# Altium project Tostado.PrjPcb
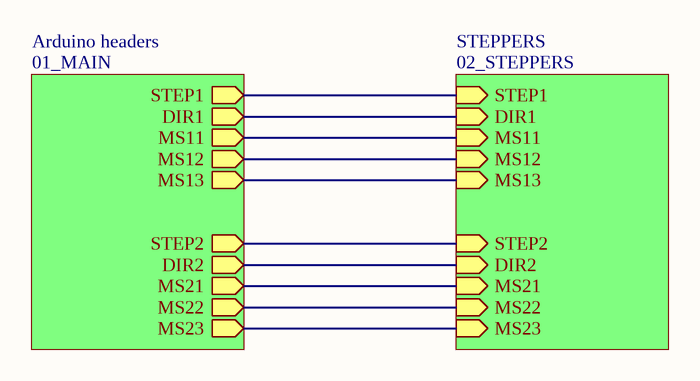
[diagram p0: GENERAL_DIAGRAMS.SchDoc]
3 sheets, 33 parts. Net scope: hierarchical (ports join the sheet entries above them; power ports are global).
Board file: Tostado.PcbDoc
Sheets:
  GENERAL_DIAGRAMS.SchDoc
    Arduino headers = 01_MAIN.SchDoc
    STEPPERS = 02_STEPPERS.SchDoc

## Sheet GENERAL_DIAGRAMS.SchDoc
size A4; SheetNumber: 1; SheetTotal: 3

### Sub-sheets
Arduino headers = 01_MAIN: STEP1 (out), DIR1 (out), MS11 (out), MS12 (out), MS13 (out), STEP2 (out), DIR2 (out), MS21 (out), MS22 (out), MS23 (out)
STEPPERS = 02_STEPPERS: STEP1 (in), DIR1 (in), MS11 (in), MS12 (in), MS13 (in), STEP2 (in), DIR2 (in), MS21 (in), MS22 (in), MS23 (in)

### Nets
3_MS22: sheet Arduino headers/MS22, sheet STEPPERS/MS22
4_MS21: sheet Arduino headers/MS21, sheet STEPPERS/MS21
4_MS23: sheet Arduino headers/MS23, sheet STEPPERS/MS23
5_MS11: sheet Arduino headers/MS11, sheet STEPPERS/MS11
6_STEP2: sheet Arduino headers/STEP2, sheet STEPPERS/STEP2
7_MS12: sheet Arduino headers/MS12, sheet STEPPERS/MS12
8_MS13: sheet Arduino headers/MS13, sheet STEPPERS/MS13
9_STEP1: sheet Arduino headers/STEP1, sheet STEPPERS/STEP1
12_DIR2: sheet Arduino headers/DIR2, sheet STEPPERS/DIR2
13_DIR1: sheet Arduino headers/DIR1, sheet STEPPERS/DIR1

## Sheet 01_MAIN.SchDoc
size A4; SheetNumber: 2; SheetTotal: 3
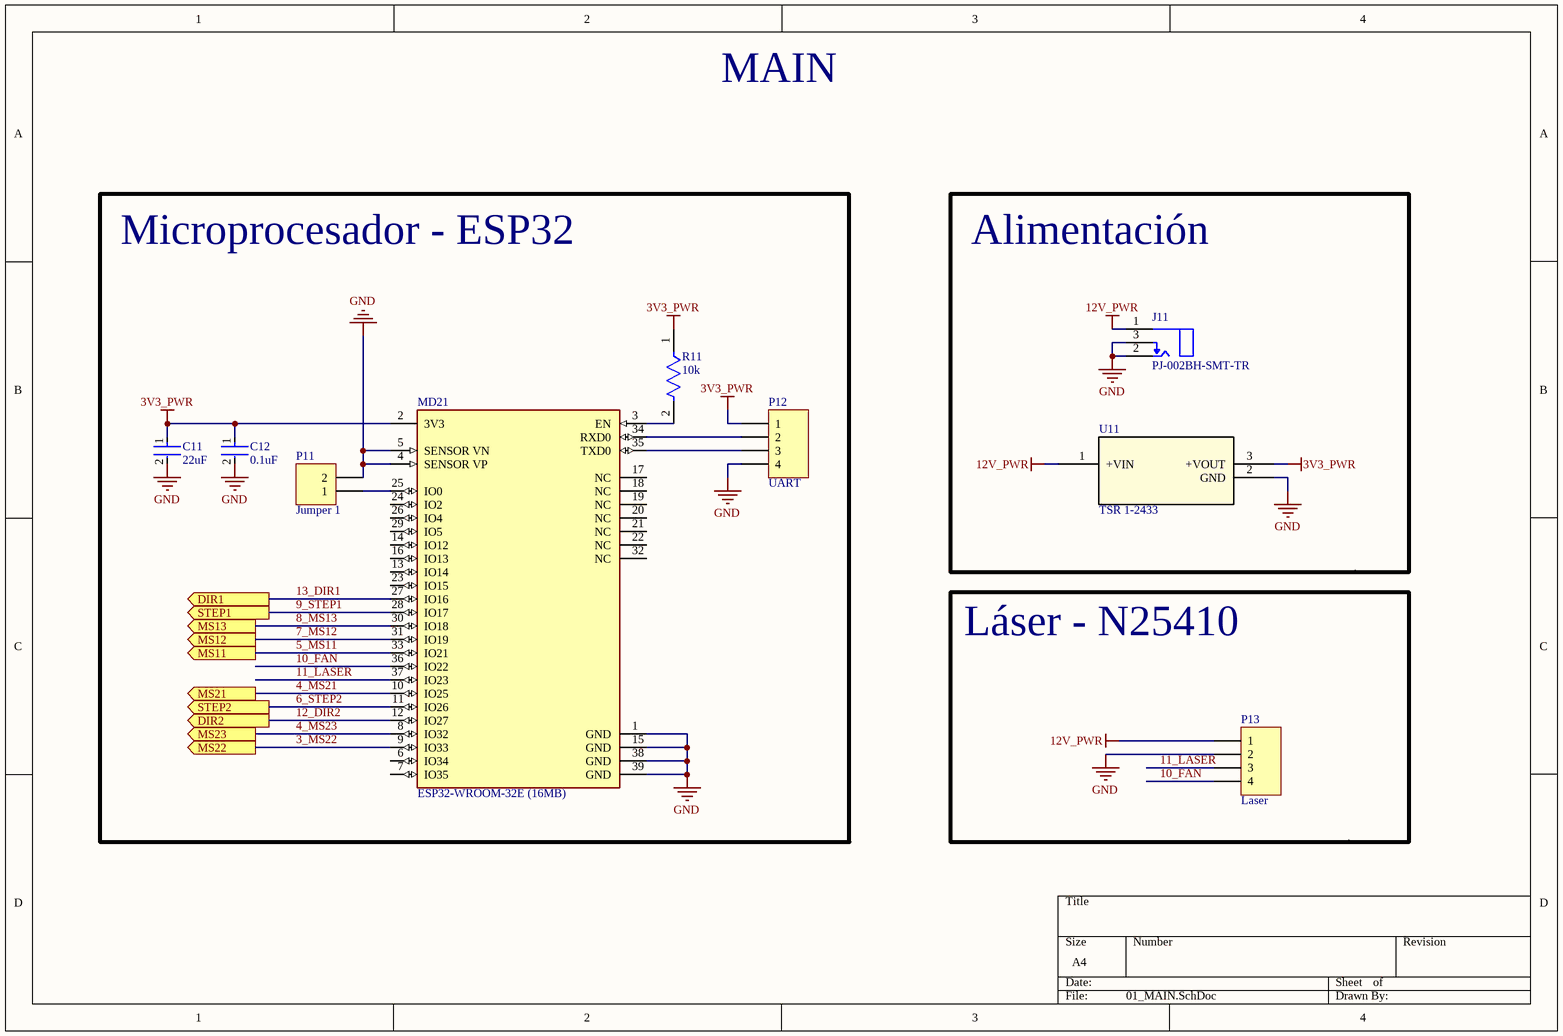
[diagram p1: 01_MAIN.SchDoc]

### Parts
C11  22uF  [FP-0603-L_1_6_0_15-W_0_81-MFG]
C12  0.1uF  [FP-CC0603-DA-IPC_A]
J11  PJ-002BH-SMT-TR  [FP-PJ-002BH-SMT-TR-MFG]
MD21  ESP32-WROOM-32E (16MB)  [FP-ESP32-WROOM-32E_16MB-MFG]
P11  Jumper 1  [HDR1X2]
P12  UART  [HDR1X4]
P13  Laser  [HDR1X4]
R11  10k  [FP-RC0603-0_55-IPC_C]
U11  TSR 1-2433  [TSR1-SINGLE_TRP]

### Blocks framed on the sheet
Microprocesador - ESP32: C11 C12 MD21 P11 P12 R11
Alimentación: J11 U11
Láser - N25410: P13

### Ports
DIR1 (out, see GENERAL_DIAGRAMS[2B], 02_STEPPERS[1B]), DIR2 (out, see GENERAL_DIAGRAMS[2B], 02_STEPPERS[3B]), MS11 (out, see GENERAL_DIAGRAMS[2B], 02_STEPPERS[1B]), MS12 (out, see GENERAL_DIAGRAMS[2B], 02_STEPPERS[1B]), MS13 (out, see GENERAL_DIAGRAMS[2B], 02_STEPPERS[1B]), MS21 (out, see GENERAL_DIAGRAMS[2B], 02_STEPPERS[3B]), MS22 (out, see GENERAL_DIAGRAMS[2B], 02_STEPPERS[3B]), MS23 (out, see GENERAL_DIAGRAMS[2C], 02_STEPPERS[3B]), STEP1 (out, see GENERAL_DIAGRAMS[2B], 02_STEPPERS[1B]), STEP2 (out, see GENERAL_DIAGRAMS[2B], 02_STEPPERS[3B])

### Nets
3V3_PWR: C11.1 C12.1 MD21.2(3V3) P12.1 R11.1 U11.3(+VOUT)
12V_PWR: J11.1 P13.1 U11.1(+VIN)
GND: C11.2 C12.2 J11.2 J11.3 MD21.1(GND) MD21.4(SENSOR_VP) MD21.5(SENSOR_VN) MD21.15(GND) MD21.38(GND) MD21.39(GND) P11.2 P12.4 P13.2 U11.2(GND)
3_MS22: MD21.9(IO33) ; port MS22
4_MS21: MD21.10(IO25) ; port MS21
4_MS23: MD21.8(IO32) ; port MS23
5_MS11: MD21.33(IO21) ; port MS11
6_STEP2: MD21.11(IO26) ; port STEP2
7_MS12: MD21.31(IO19) ; port MS12
8_MS13: MD21.30(IO18) ; port MS13
9_STEP1: MD21.28(IO17) ; port STEP1
10_FAN: MD21.36(IO22) P13.4
11_LASER: MD21.37(IO23) P13.3
12_DIR2: MD21.12(IO27) ; port DIR2
13_DIR1: MD21.27(IO16) ; port DIR1
NetMD21_3: MD21.3(EN) R11.2
NetMD21_25: MD21.25(IO0) P11.1
NetMD21_34: MD21.34(RXD0) P12.2
NetMD21_35: MD21.35(TXD0) P12.3

Not connected (* = marked no-connect by the designer): MD21 6(IO34) 7(IO35) 13(IO14) 14(IO12) 16(IO13) 17(NC) 18(NC) 19(NC) 20(NC) 21(NC) 22(NC) 23(IO15) 24(IO2) 26(IO4) 29(IO5) 32(NC)

### Notes on the sheet
- MAIN

### Library data of the parts
C11 = CMP-04427-003008-1: General Purpose Ceramic Capacitor, 0603, 22uF, 20%, X5R, 15%, 10V; Manufacturer: Kyocera AVX; Manufacturer Part Number: 0603ZD226MAT2A; Capacitance: 22uF; Voltage Rating (DC): 10V; Tolerance: 20%; Case/Package: 0603; RoHS Compliant: Yes; Dielectric: X5R; Supplier: Mouser; Supplier Part Number: 581-0603ZD226MAT2A; RoHS: Yes; Category: Ceramic Capacitors; Stock: 77; Pricing: 1=0,58, 10=0,311, 50=0,311, 100=0,2, 1000=0,169, 10000=0,138 (USD); Value: 22uF
C12 = CMP-03422-001490-1: CAP CER 0.1UF 50V X7R 0603; Manufacturer: Yageo; Manufacturer Part Number: CC0603JRX7R9BB104; Capacitance: 100nF; Tolerance: 5%; Value: 100nF; Number of Pins: 2; Depth: 0.8mm; Weight: 7.1E-05oz; Radiation Hardening: No; Case Code (Metric): 1608; Dielectric: X7R; Max Operating Temperature: 125°C; Voltage Rating (DC): 50V; Case/Package: 0603; Halogen Free: Halogen Free; Mount: Surface Mount; Lead Free: Lead Free; Termination: SMD/SMT; RoHS Compliant: Yes; Length: 1.6mm; Series: CC; Resistor Type: Ceramic; Case Code (Imperial): 0603; Construction: Flat; Width: 0.031inch; Height: 0.8mm; Voltage Rating: 50V; Min Operating Temperature: -55°C; Thickness: 0.035inch; Packaging: Tape and Reel; Supplier: Mouser; Supplier Part Number: 603-CC603JRX7R9BB104; RoHS: Yes; Category: Ceramic Capacitors; Stock: 7435233; Pricing: 1=0,1, 10=0,04, 50=0,04, 100=0,024, 1000=0,018, 10000=0,009 (USD); Mounting Technology: Surface Mount; Pins: 2; ComponentLink1URL: https://datasheet.ciiva.com/11465/upy-gphc-x7r-6-3v-to-50v-8-11465038.pdf?src-supplier=Avnet; ComponentLink1Description: https://datasheet.ciiva.com/11465/upy-gphc-x7r-6-3v-to-50v-8-11465038.pdf?src-supplier=Avnet
J11 = CMP-2000-06897-2: CONN PWR JACK 2.5X5.5MM SOLDER; Manufacturer: CUI Inc; Current Rating: 5A; Standoff Height: 0.1mm; Voltage Rating: 24V; Conn Gender: Male; Conn Orientation: Right Angle; Number Of Contacts: 3; Temperature Range Low: -25°C; Category: Conn; Package: 0; Device Class L2: Power Connectors; Contact Material: Nickel,Silver; Automotive: No; Mouser Description: 2.5 mm Center Pin, 5.0 A, Right Angle, Surface Mount (SMT), Dc Power Jack Connector; Device Class L3: unset; ComponentLink2URL: https://www.cuidevices.com/product/resource/digikeypdf/pj-002bh-smt-tr.pdf; Octopart: https://octopart.com/pj-002bh-smt-tr-cui-25947151; Manufacturer Part Number: PJ-002BH-SMT-TR; Lead Free: Yes; ComponentLink2Description: Datasheet; Digikey Description: CONN PWR JACK 2.5X5.5MM SOLDER; Height: 11.43mm; Temperature: -25°C to +85°C; RoHS: TRUE; Device Class L1: Connectors; Temperature Range High: +85°C
MD21 = CMP-194065-000027-1: RX TXRX MOD WIFI TRACE ANT SMD
P11 = Header 2: Header, 2-Pin; LatestRevisionDate: 17-Jul-2002; LatestRevisionNote: Re-released for DXP Platform.; Publisher: Altium Limited
P12 P13 = Header 4: Header, 4-Pin; LatestRevisionDate: 17-Jul-2002; LatestRevisionNote: Re-released for DXP Platform.; Publisher: Altium Limited
R11 = CMP-2100-03664-2: RES 10K OHM 1% 1/10W 0603; Manufacturer: Yageo; Manufacturer Part Number: RC0603FR-0710KL; Voltage Rating: 75V; Voltage Rating (DC): 50V; Resistance: 10kR; Power Rating: 100mW; Temperature Coefficient: 100ppm/°C; Value: 10kR; Depth: 0.8mm; Termination: SMD/SMT; Resistor Type: Thick Film; Series: RC; Construction: Rectangular; Features: Moisture Resistant; Packaging: Tape and Reel; Min Operating Temperature: -55°C; Number of Terminations: 2; Lead Pitch: 0.3mm; RoHS Compliant: Yes; Case/Package: 0603; Resistance Tolerance: 1%; Military Standard: Not; Weight: 7.1E-05oz; Number of Pins: 2; Tolerance: 1%; Length: 1.6mm; Case Code (Imperial): 0603; Lead Free: Lead Free; Width: 0.8mm; Max Power Dissipation: 100mW; Height: 0.45mm; Max Operating Temperature: 155°C; Case Code (Metric): 1608; Size Code: 0603; Supplier: Future Electronics; Supplier Part Number: 3349388; RoHS: Yes; Category: Chip SMD Resistors; Stock: 252943; Pricing: 1=0,1, 20=0,0661, 100=0,048, 500=0,0298, 2500=0,0116 (USD); Pins: 2; Reach SVHC Compliant: No
U11 = CMP-2000-05426-2: NexarPartId: 9539342; Manufacturer: Traco Power; Nominal Output Voltage: 3.3V; Max Input Voltage: 36V; Max Output Power: 3.3W; Min Input Voltage: 4.75V; Nominal Supply Current: 1mA; Output Type: Fixed; Max Output Current: 1A; Min Input Voltage (DC): 5.5V; Efficiency: 79%; Number of Outputs: 1; Isolation: Isolated; Max Input Voltage (DC): 32V; Switching Frequency: 500kHz; Radiation Hardening: No; REACH SVHC: No SVHC; Mount: Through Hole; Height: 10.2mm; Max Operating Temperature: 85°C; RoHS: Compliant; Output Power: 3.3W; Min Supply Voltage: 4.75V; Weight: 1.9g; Power Rating: 3.3W; Number of Pins: 3; Output Current: 1A; Min Operating Temperature: -40°C; Length: 11.7mm; Case/Package: SIP; Output Voltage: 3.3V; Max Supply Voltage: 36V; Depth: 7.6mm; Width: 7.6mm; Supplier: Mouser; Supplier Part Number: 495-TSR-1-2433; Manufacturer Part Number: TSR1-2433; Category: Uncategorized; Stock: 10749; Pricing: 1=6,15, 10=5,97, 50=5,61, 100=5,44, 1000=4,74, 10000=4,74 (USD); Mounting Technology: Through Hole; Pins: 3; Series: TSR 1; Voltage - Output 1: 3.3V; Features: SCP; Max Power Dissipation: 3.3W; RoHS Compliant: Yes; Reach SVHC Compliant: No; ComponentLink1URL: https://datasheet.ciiva.com/26336/156671-da-01-en-dc-dc-wandler-1a-tsr-1-2433-26336397.pdf?src-supplier=Conrad; ComponentLink1Description: https://datasheet.ciiva.com/26336/156671-da-01-en-dc-dc-wandler-1a-tsr-1-2433-26336397.pdf?src-supplier=Conrad; ComponentLink2URL: https://datasheet.ciiva.com/3355/tsr1-eng-tds-3355819.pdf?src-supplier=Distrelec; ComponentLink2Description: https://datasheet.ciiva.com/3355/tsr1-eng-tds-3355819.pdf?src-supplier=Distrelec

## Sheet 02_STEPPERS.SchDoc
size A4; SheetNumber: 3; SheetTotal: 3
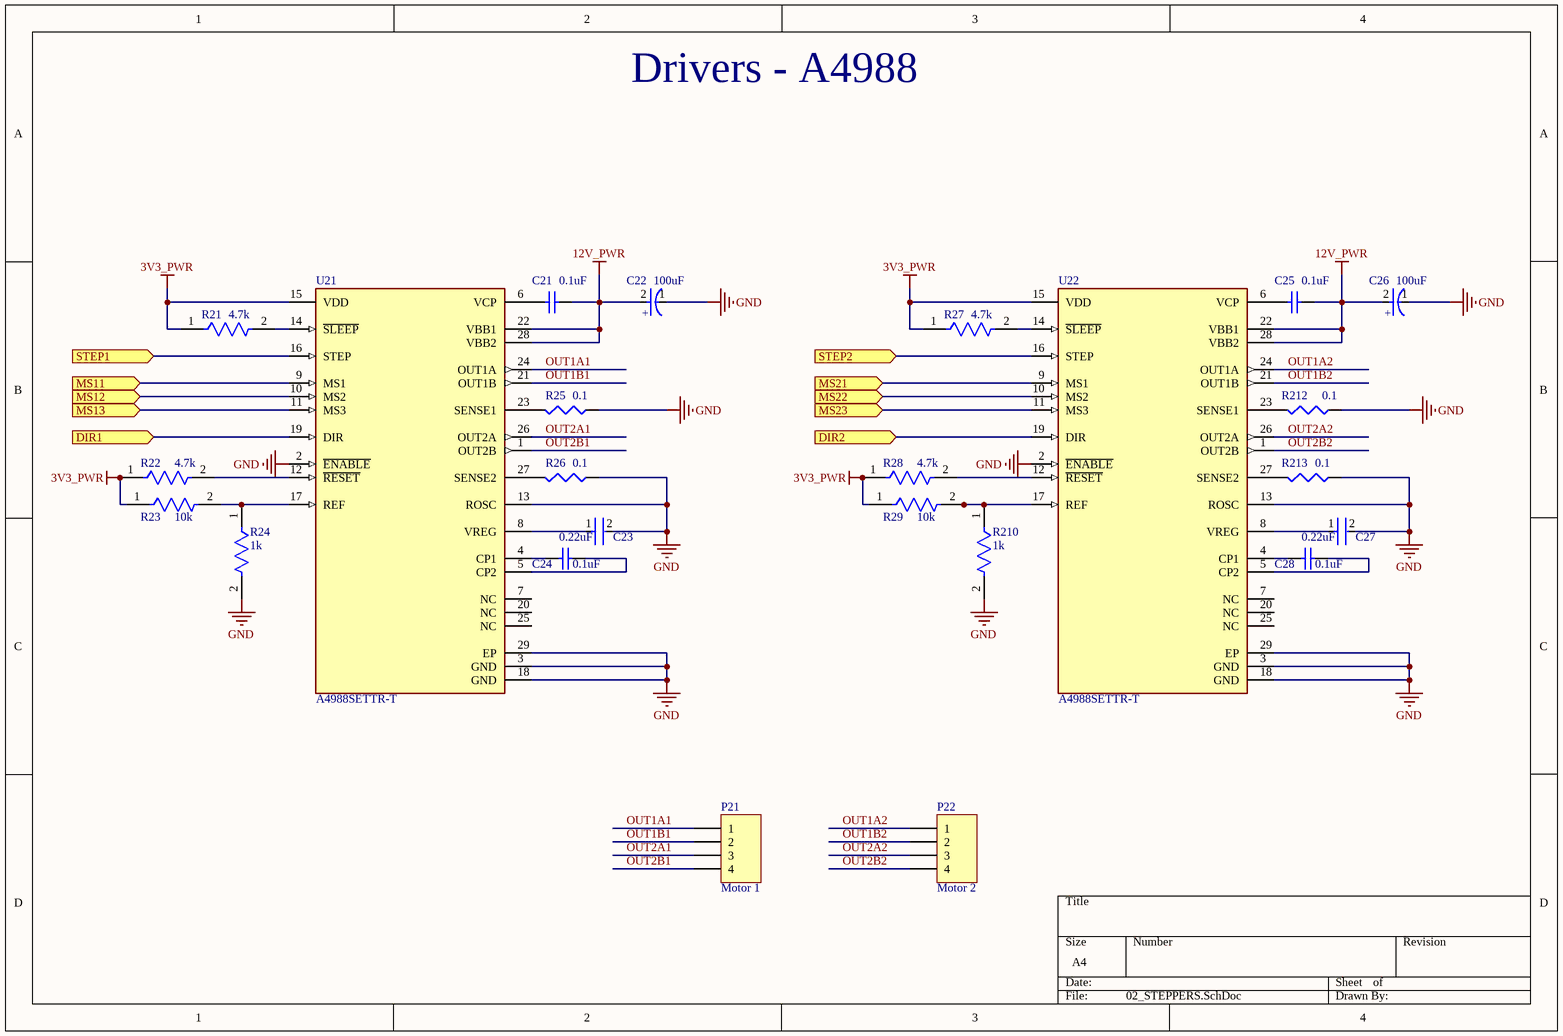
[diagram p2: 02_STEPPERS.SchDoc]

### Parts
C21  0.1uF  [CAPC1608X90X35ML15T15]
C22  100uF  [FP-MAL2150-1010-MFG]
C23  0.22uF  [FP-GCM188-0_1-IPC_B]
C24  0.1uF  [CAPC1608X90X35ML15T15]
C25  0.1uF  [CAPC1608X90X35ML15T15]
C26  100uF  [FP-MAL2150-1010-MFG]
C27  0.22uF  [FP-GCM188-0_1-IPC_B]
C28  0.1uF  [CAPC1608X90X35ML15T15]
P21  Motor 1  [HDR1X4]
P22  Motor 2  [HDR1X4]
R21  4.7k  [FP-MCT0603-IPC_B]
R22  4.7k  [FP-MCT0603-IPC_B]
R23  10k  [FP-AC0603-MFG]
R24  1k  [FP-RC0603-0_55-IPC_C]
R25  value 0.1  [J1-0603]  (hidden comment: Res3)
R26  value 0.1  [J1-0603]  (hidden comment: Res3)
R27  4.7k  [FP-MCT0603-IPC_B]
R28  4.7k  [FP-MCT0603-IPC_B]
R29  10k  [FP-AC0603-MFG]
R210  1k  [FP-RC0603-0_55-IPC_C]
R212  value 0.1  [J1-0603]  (hidden comment: Res3)
R213  value 0.1  [J1-0603]  (hidden comment: Res3)
U21  A4988SETTR-T  [FP-ET-28-MFG]
U22  A4988SETTR-T  [FP-ET-28-MFG]

### Ports
DIR1 (in, see GENERAL_DIAGRAMS[3B], 01_MAIN[1C]), DIR2 (in, see GENERAL_DIAGRAMS[3B], 01_MAIN[1C]), MS11 (in, see GENERAL_DIAGRAMS[3B], 01_MAIN[1C]), MS12 (in, see GENERAL_DIAGRAMS[3B], 01_MAIN[1C]), MS13 (in, see GENERAL_DIAGRAMS[3B], 01_MAIN[1C]), MS21 (in, see GENERAL_DIAGRAMS[3B], 01_MAIN[1C]), MS22 (in, see GENERAL_DIAGRAMS[3B], 01_MAIN[1C]), MS23 (in, see GENERAL_DIAGRAMS[3C], 01_MAIN[1C]), STEP1 (in, see GENERAL_DIAGRAMS[3B], 01_MAIN[1C]), STEP2 (in, see GENERAL_DIAGRAMS[3B], 01_MAIN[1C])

### Nets
3V3_PWR: R21.1 R22.1 R23.1 R27.1 R28.1 R29.1 U21.15(VDD) U22.15(VDD)
12V_PWR: C21.2 C22.2(A) C25.2 C26.2(A) U21.22(VBB1) U21.28(VBB2) U22.22(VBB1) U22.28(VBB2)
GND: C22.1(C) C23.2 C26.1(C) C27.2 R24.2 R25.1 R26.1 R210.2 R212.1 R213.1 U21.2(~{ENABLE}) U21.3(GND) U21.13(ROSC) U21.18(GND) U21.29(EP) U22.2(~{ENABLE}) U22.3(GND) U22.13(ROSC) U22.18(GND) U22.29(EP)
3_MS22: U22.10(MS2) ; port MS22
4_MS21: U22.9(MS1) ; port MS21
4_MS23: U22.11(MS3) ; port MS23
5_MS11: U21.9(MS1) ; port MS11
6_STEP2: U22.16(STEP) ; port STEP2
7_MS12: U21.10(MS2) ; port MS12
8_MS13: U21.11(MS3) ; port MS13
9_STEP1: U21.16(STEP) ; port STEP1
12_DIR2: U22.19(DIR) ; port DIR2
13_DIR1: U21.19(DIR) ; port DIR1
OUT1A1: P21.1 U21.24(OUT1A)
OUT1A2: P22.1 U22.24(OUT1A)
OUT1B1: P21.2 U21.21(OUT1B)
OUT1B2: P22.2 U22.21(OUT1B)
OUT2A1: P21.3 U21.26(OUT2A)
OUT2A2: P22.3 U22.26(OUT2A)
OUT2B1: P21.4 U21.1(OUT2B)
OUT2B2: P22.4 U22.1(OUT2B)
NetC21_1: C21.1 U21.6(VCP)
NetC23_1: C23.1 U21.8(VREG)
NetC24_1: C24.1 U21.5(CP2)
NetC24_2: C24.2 U21.4(CP1)
NetC25_1: C25.1 U22.6(VCP)
NetC27_1: C27.1 U22.8(VREG)
NetC28_1: C28.1 U22.5(CP2)
NetC28_2: C28.2 U22.4(CP1)
NetR21_2: R21.2 U21.14(~{SLEEP})
NetR22_2: R22.2 U21.12(~{RESET})
NetR23_2: R23.2 R24.1 U21.17(REF)
NetR25_2: R25.2 U21.23(SENSE1)
NetR26_2: R26.2 U21.27(SENSE2)
NetR27_2: R27.2 U22.14(~{SLEEP})
NetR28_2: R28.2 U22.12(~{RESET})
NetR29_2: R29.2 R210.1 U22.17(REF)
NetR212_2: R212.2 U22.23(SENSE1)
NetR213_2: R213.2 U22.27(SENSE2)

Not connected (* = marked no-connect by the designer): U21 7(NC) 20(NC) 25(NC); U22 7(NC) 20(NC) 25(NC)

### Notes on the sheet
- Drivers - A4988
- (in symbol CMP-02412-000026-1) +

### Library data of the parts
C21 C24 C25 C28 = CMP-2006-02075-1: Part Number: 06033C104KAT4A; Manufacturer: AVX Interconnect / Elco; Value: 100nF; Tolerance: 10%; Dielectric: X7R; Voltage Rating: 25V; Supplier: Digi-Key; Supplier Part Number: 478-7018-1-ND; Manufacturer Part Number: 06033C104KAT4A; RoHS: Yes; Category: Ceramic Capacitors; Stock: 1374924; Pricing: 1=0,1, 10=0,039, 50=0,0212, 100=0,0173, 500=0,01238, 1000=0,00972, 2500=0,00884, 5000=0,00813 (USD); Mounting Technology: Surface Mount; Case/Package: 0603; Pins: 2; Case Code (Metric): 1608; Case Code (Imperial): 0603; Min Operating Temperature: -55°C; Max Operating Temperature: 125°C; Packaging: Cut Tape; Series: -; Length: 1.6mm; Depth: 0.81mm; Reach SVHC Compliant: No; Lead Free: Lead Free; RoHS Compliant: Yes; ComponentLink1URL: https://datasheet.ciiva.com/22619/1679506-22619862.pdf?src-supplier=Element14; ComponentLink1Description: https://datasheet.ciiva.com/22619/1679506-22619862.pdf?src-supplier=Element14; ComponentLink2URL: https://datasheet.ciiva.com/28613/1679506-28613035.pdf?src-supplier=Element14; ComponentLink2Description: https://datasheet.ciiva.com/28613/1679506-28613035.pdf?src-supplier=Element14; ComponentLink3URL: https://datasheet.ciiva.com/6277/cx7r-6277758.pdf?src-supplier=Digi-Key; ComponentLink3Description: https://datasheet.ciiva.com/6277/cx7r-6277758.pdf?src-supplier=Digi-Key; ComponentLink4URL: https://datasheet.ciiva.com/6277/cx7r-6277759.pdf?src-supplier=Digi-Key; ComponentLink4Description: https://datasheet.ciiva.com/6277/cx7r-6277759.pdf?src-supplier=Digi-Key
C22 C26 = CMP-02412-000026-1: CAP ALUM 100UF 20% 50V SMD; Manufacturer: Vishay BCcomponents; Manufacturer Part Number: MAL215097101E3; Impedance: 240mR; Dissipation Factor: 0.12%; Ripple Current (AC): 490mA; Dielectric Material: Aluminium; Life (Hours): 3000Hour; Voltage Rating (DC): 50V; Capacitance: 100uF; Voltage Rating: 50V; Max Operating Temperature: 105°C; Width: 10mm; Construction: Cylindrical; ESR (Equivalent Series Resistance): 240mR; Radiation Hardening: No; Length: 10mm; Case/Package: Radial; Packaging: Tape and Reel; Min Operating Temperature: -55°C; Package Quantity: 500; RoHS Compliant: Yes; Series: Automotive, AEC-Q200, 150 CRZ; Ripple Current: 490mA; Height: 10mm; Tolerance: 20%; Diameter: 10mm; Termination: SMD/SMT; Supplier: Digi-Key; Supplier Part Number: BC5165CT-ND; RoHS: Yes; Category: Aluminum Electrolytic Capacitors; Stock: 6366; Pricing: 1=2,21, 10=1,787, 50=1,5594, 100=1,3645 (USD); Value: 100uF; Reach SVHC Compliant: Unknown; ComponentLink1URL: https://datasheet.ciiva.com/22698/1839053-22698438.pdf?src-supplier=Element14; ComponentLink1Description: https://datasheet.ciiva.com/22698/1839053-22698438.pdf?src-supplier=Element14; ComponentLink2URL: https://datasheet.ciiva.com/1455/1839053-1455747.pdf?src-supplier=Element14; ComponentLink2Description: https://datasheet.ciiva.com/1455/1839053-1455747.pdf?src-supplier=Element14
C23 C27 = CMP-06035-005079-1: Ceramic Capacitor for Automotive 220nF  ±10% 25VDC X7R 0603 Paper T/R; Manufacturer: Murata; Manufacturer Part Number: GCM188R71E224KA55J; Voltage Rating (DC): 25V; Lead Free: Lead Free; Case/Package: 0603; Case Code (Imperial): 0603; Radiation Hardening: No; Width: 0.8mm; Termination: SMD/SMT; Mount: Surface Mount; Min Operating Temperature: -55°C; Depth: 0.8mm; Voltage Rating: 25V; Ratings: AEC-Q200; Dielectric: X7R; Thickness: 0.035inch; Height: 0.8mm; Packaging: Tape and Reel; Length: 1.6mm; Case Code (Metric): 1608; Package Quantity: 10000; Tolerance: 10%; Capacitance: 220nF; Max Operating Temperature: 125°C; Supplier: Digi-Key; Supplier Part Number: 490-8017-1-ND; RoHS: Yes; Category: Ceramic Capacitors; Stock: 516546; Pricing: 1=0,11, 10=0,08, 50=0,0436, 100=0,0356, 500=0,02546, 1000=0,02, 2500=0,01818, 5000=0,01673 (USD); Mounting Technology: Surface Mount; Value: 220nF; Series: GCM; Construction: Flat; RoHS Compliant: Yes; ComponentLink1URL: https://datasheet.ciiva.com/29541/product-29541560.pdf?src-supplier=Digi-Key; ComponentLink1Description: https://datasheet.ciiva.com/29541/product-29541560.pdf?src-supplier=Digi-Key; ComponentLink2URL: https://datasheet.ciiva.com/11619/product-11619017.pdf?src-supplier=Avnet; ComponentLink2Description: https://datasheet.ciiva.com/11619/product-11619017.pdf?src-supplier=Avnet; ComponentLink3URL: https://datasheet.ciiva.com/29541/product-29541578.pdf?src-supplier=Digi-Key; ComponentLink3Description: https://datasheet.ciiva.com/29541/product-29541578.pdf?src-supplier=Digi-Key; ComponentLink4URL: https://datasheet.ciiva.com/29541/product-29541579.pdf?src-supplier=Digi-Key; ComponentLink4Description: https://datasheet.ciiva.com/29541/product-29541579.pdf?src-supplier=Digi-Key
P21 P22 = Header 4: Header, 4-Pin; LatestRevisionDate: 17-Jul-2002; LatestRevisionNote: Re-released for DXP Platform.; Publisher: Altium Limited
R21 R22 R27 R28 = CMP-02407-000771-1: RES SMD 100 OHM 1% 1/8W 0603; Manufacturer: Vishay BCcomponents; Manufacturer Part Number: MCT0603MD4701BP500; Temperature Coefficient: 25ppm/°C; Max Power Dissipation: 125mW; Resistance: 4.7kR; Tolerance: 0.1%; Value: 4.7kR; Number of Terminations: 2; Features: Automotive AEC-Q200; Composition: Thin Film; Case/Package: 0603; Min Operating Temperature: -55°C; Packaging: Tape and Reel; Max Operating Temperature: 155°C; Supplier 1: Mouser; RoHS: Yes; Category: Chip SMD Resistors; Stock 1: 4730; Pricing 1: 1=0,65, 10=0,463, 50=0,463, 100=0,238, 1000=0,13, 10000=0,123 (USD); Series: MCT AT - Precision; RoHS Compliant: Yes; ComponentLink1URL: http://www.vishay.com/docs/28785/mcat_pre.pdf?src-supplier=Digi-Key; ComponentLink1Description: http://www.vishay.com/docs/28785/mcat_pre.pdf?src-supplier=Digi-Key
R23 R29 = CMP-2000-04818-3: RES 10KΩ 1.00% 0.1W 0603; Manufacturer: Yageo; Manufacturer Part Number: AC0603FR-0710KL; Power Rating: 100mW; Tolerance: 1%; Resistance: 10kR; Voltage Rating: 50V; Temperature Coefficient: 100ppm/°C; Value: 10kR; Ratings: AEC-Q200; Case Code (Metric): 1608; Max Power Dissipation: 100mW; Height: 0.45mm; Package Quantity: 1; Max Operating Temperature: 155°C; Resistor Type: Thick Film; Depth: 0.8mm; RoHS Compliant: Yes; Min Operating Temperature: -55°C; Packaging: Tape and Reel; Number of Terminations: 2; Length: 1.6mm; Features: Moisture Resistant; Military Standard: Not; Case Code (Imperial): 0603; Size Code: 0603; Termination: SMD/SMT; Case/Package: 0603; Mount: Surface Mount; Width: 0.8mm; Lead Free: Lead Free; Series: AC; Construction: Rectangular; Supplier 1: Mouser; RoHS: Yes; Category: Chip SMD Resistors; Stock 1: 1450617; Pricing 1: 1=0,1, 10=0,003, 50=0,003, 100=0,003, 1000=0,003, 10000=0,002 (USD); Mounting Technology: Surface Mount; ComponentLink1URL: https://datasheet.ciiva.com/26862/getdatasheetpartid-724997-26862461.pdf?src-supplier=Verical; ComponentLink1Description: https://datasheet.ciiva.com/26862/getdatasheetpartid-724997-26862461.pdf?src-supplier=Verical
R24 R210 = CMP-1659-00009-5: RES 1K OHM 1% 1/10W 0603; Manufacturer: Yageo; Manufacturer Part Number: RC0603FR-071KL; Resistance: 1kR; Voltage Rating: 50V; Power Rating: 100mW; Temperature Coefficient: 100ppm/°C; Value: 1kR; Military Standard: Not; REACH SVHC: No SVHC; Size Code: 0603; Features: Moisture Resistant; Number of Terminations: 2; Technology: THICK FILM; Series: RC; Case Code (Metric): 1608; Resistance Tolerance: 1%; Resistor Type: Thick Film; Termination: SMD/SMT; Contact Plating: Tin; Radiation Hardening: No; Min Operating Temperature: -55°C; Max Operating Temperature: 155°C; Packaging: Tape and Reel; Max Power Dissipation: 100mW; RoHS Compliant: Yes; Height: 0.45mm; Lead Free: Lead Free; Case/Package: 0603; Length: 1.6mm; Tolerance: 1%; Case Code (Imperial): 0603; Construction: Rectangular; Depth: 0.8mm; Supplier 1: Mouser; RoHS: Yes; Category: Chip SMD Resistors; Stock 1: 9884296; Pricing 1: 1=0,1, 10=0,019, 50=0,019, 100=0,007, 1000=0,004, 10000=0,002 (USD); Reach SVHC Compliant: No
R25 R26 R212 R213 = Res3: Thick Film Surface Mount Chip Resistor 0603 Size 0.1 Ohm 5% 0.1 W ±400 ppm/°C 2-Pin SMD T/R; Manufacturer: Vishay Dale; Manufacturer Part Number: RCWL0603R100JQEA; Max Power Dissipation: 100mW; Published: 8-Jun-2000; LatestRevisionDate: 29-May-2009; LatestRevisionNote: IPC-7351 Footprint Added.; PackageReference: J1-0603; Publisher: Altium Limited; PackageDescription: Chip Resistor; Supplier 1: Mouser; RoHS: Yes; Category: Chip SMD Resistors; Stock 1: 12117; Pricing 1: 1=0,35, 10=0,303, 50=0,303, 100=0,119, 1000=0,05, 10000=0,038 (USD); Case/Package: 0603; Min Operating Temperature: -55°C; Max Operating Temperature: 155°C; Packaging: Tape and Reel; Number of Terminations: 2; Tolerance: 5%; Temperature Coefficient: 400ppm/°C; Features: Moisture Resistant,Automotive AEC-Q200; Series: RCWL; Length: 0.061inch; Width: 0.033inch; Height: 0.02inch; RoHS Compliant: Yes; ComponentLink1URL: http://www.vishay.com/docs/20018/rcwl.pdf?src-supplier=Digi-Key; ComponentLink1Description: http://www.vishay.com/docs/20018/rcwl.pdf?src-supplier=Digi-Key
U21 U22 = CMP-1742-00003-2: IC MTR DRVR BIPOLAR 3-5.5V 28QFN; Manufacturer: Allegro MicroSystems; Number of Outputs: 1; Motor Type: Stepper; Output Current: 2A; Min Supply Voltage: 8V; Output Voltage: 35V; Interface: Logic; Package Quantity: 1; Max Operating Temperature: 85°C; Case/Package: QFN EP; Mount: Surface Mount; Packaging: Tape and Reel; Radiation Hardening: No; REACH SVHC: No SVHC; Min Operating Temperature: -20°C; Max Supply Voltage: 35V; Number of Pins: 28; Supplier: Digi-Key; Supplier Part Number: 620-1343-1-ND; Manufacturer Part Number: A4988SETTR-T; RoHS: Yes; Category: Motor Drivers; Stock: 345; Pricing: 1=3,11, 10=2,795, 25=2,642, 100=2,2897, 250=2,17228, 500=1,94918 (USD); Mounting Technology: Surface Mount; Pins: 28; Series: -; Technology: DMOS; Reach SVHC Compliant: No; RoHS Compliant: Yes; ComponentLink1URL: https://datasheet.ciiva.com/1147/1481258-1147170.pdf?src-supplier=Element14; ComponentLink1Description: https://datasheet.ciiva.com/1147/1481258-1147170.pdf?src-supplier=Element14; ComponentLink2URL: https://datasheet.ciiva.com/1608/a4988-datasheet-1608449.pdf?src-supplier=Newark; ComponentLink2Description: https://datasheet.ciiva.com/1608/a4988-datasheet-1608449.pdf?src-supplier=Newark; ComponentLink3URL: https://datasheet.ciiva.com/15109/getdatasheetpartid-557828-15109654.pdf?src-supplier=Verical; ComponentLink3Description: https://datasheet.ciiva.com/15109/getdatasheetpartid-557828-15109654.pdf?src-supplier=Verical; ComponentLink4URL: https://datasheet.ciiva.com/3229/a4988-datasheet-3229532.pdf?src-supplier=Avnet; ComponentLink4Description: https://datasheet.ciiva.com/3229/a4988-datasheet-3229532.pdf?src-supplier=Avnet

## Nets that join several sheets
3V3_PWR: 01_MAIN (6 pins), 02_STEPPERS (8 pins)
12V_PWR: 01_MAIN (J11.1 P13.1 U11.1), 02_STEPPERS (8 pins)
GND: 01_MAIN (14 pins), 02_STEPPERS (20 pins)
3_MS22: 01_MAIN (MD21.9), 02_STEPPERS (U22.10)
4_MS21: 01_MAIN (MD21.10), 02_STEPPERS (U22.9)
4_MS23: 01_MAIN (MD21.8), 02_STEPPERS (U22.11)
5_MS11: 01_MAIN (MD21.33), 02_STEPPERS (U21.9)
6_STEP2: 01_MAIN (MD21.11), 02_STEPPERS (U22.16)
7_MS12: 01_MAIN (MD21.31), 02_STEPPERS (U21.10)
8_MS13: 01_MAIN (MD21.30), 02_STEPPERS (U21.11)
9_STEP1: 01_MAIN (MD21.28), 02_STEPPERS (U21.16)
12_DIR2: 01_MAIN (MD21.12), 02_STEPPERS (U22.19)
13_DIR1: 01_MAIN (MD21.27), 02_STEPPERS (U21.19)